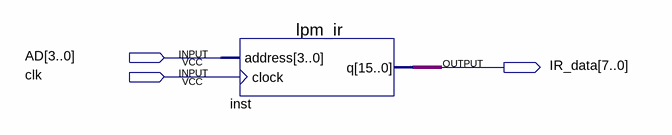
[diagram p0: schematic sheet]
// Quartus schematic Block1.bdf as structural Verilog: 1 symbols, 3 pins
module Block1 (
  input  [3:0] AD,
  input  clk,
  output [7:0] IR_data
);

  lpm_ir inst (.address(AD), .clock(clk), .q(IR_data));
endmodule
